# EAGLE schematic untitled (EAGLE 8.7.0)
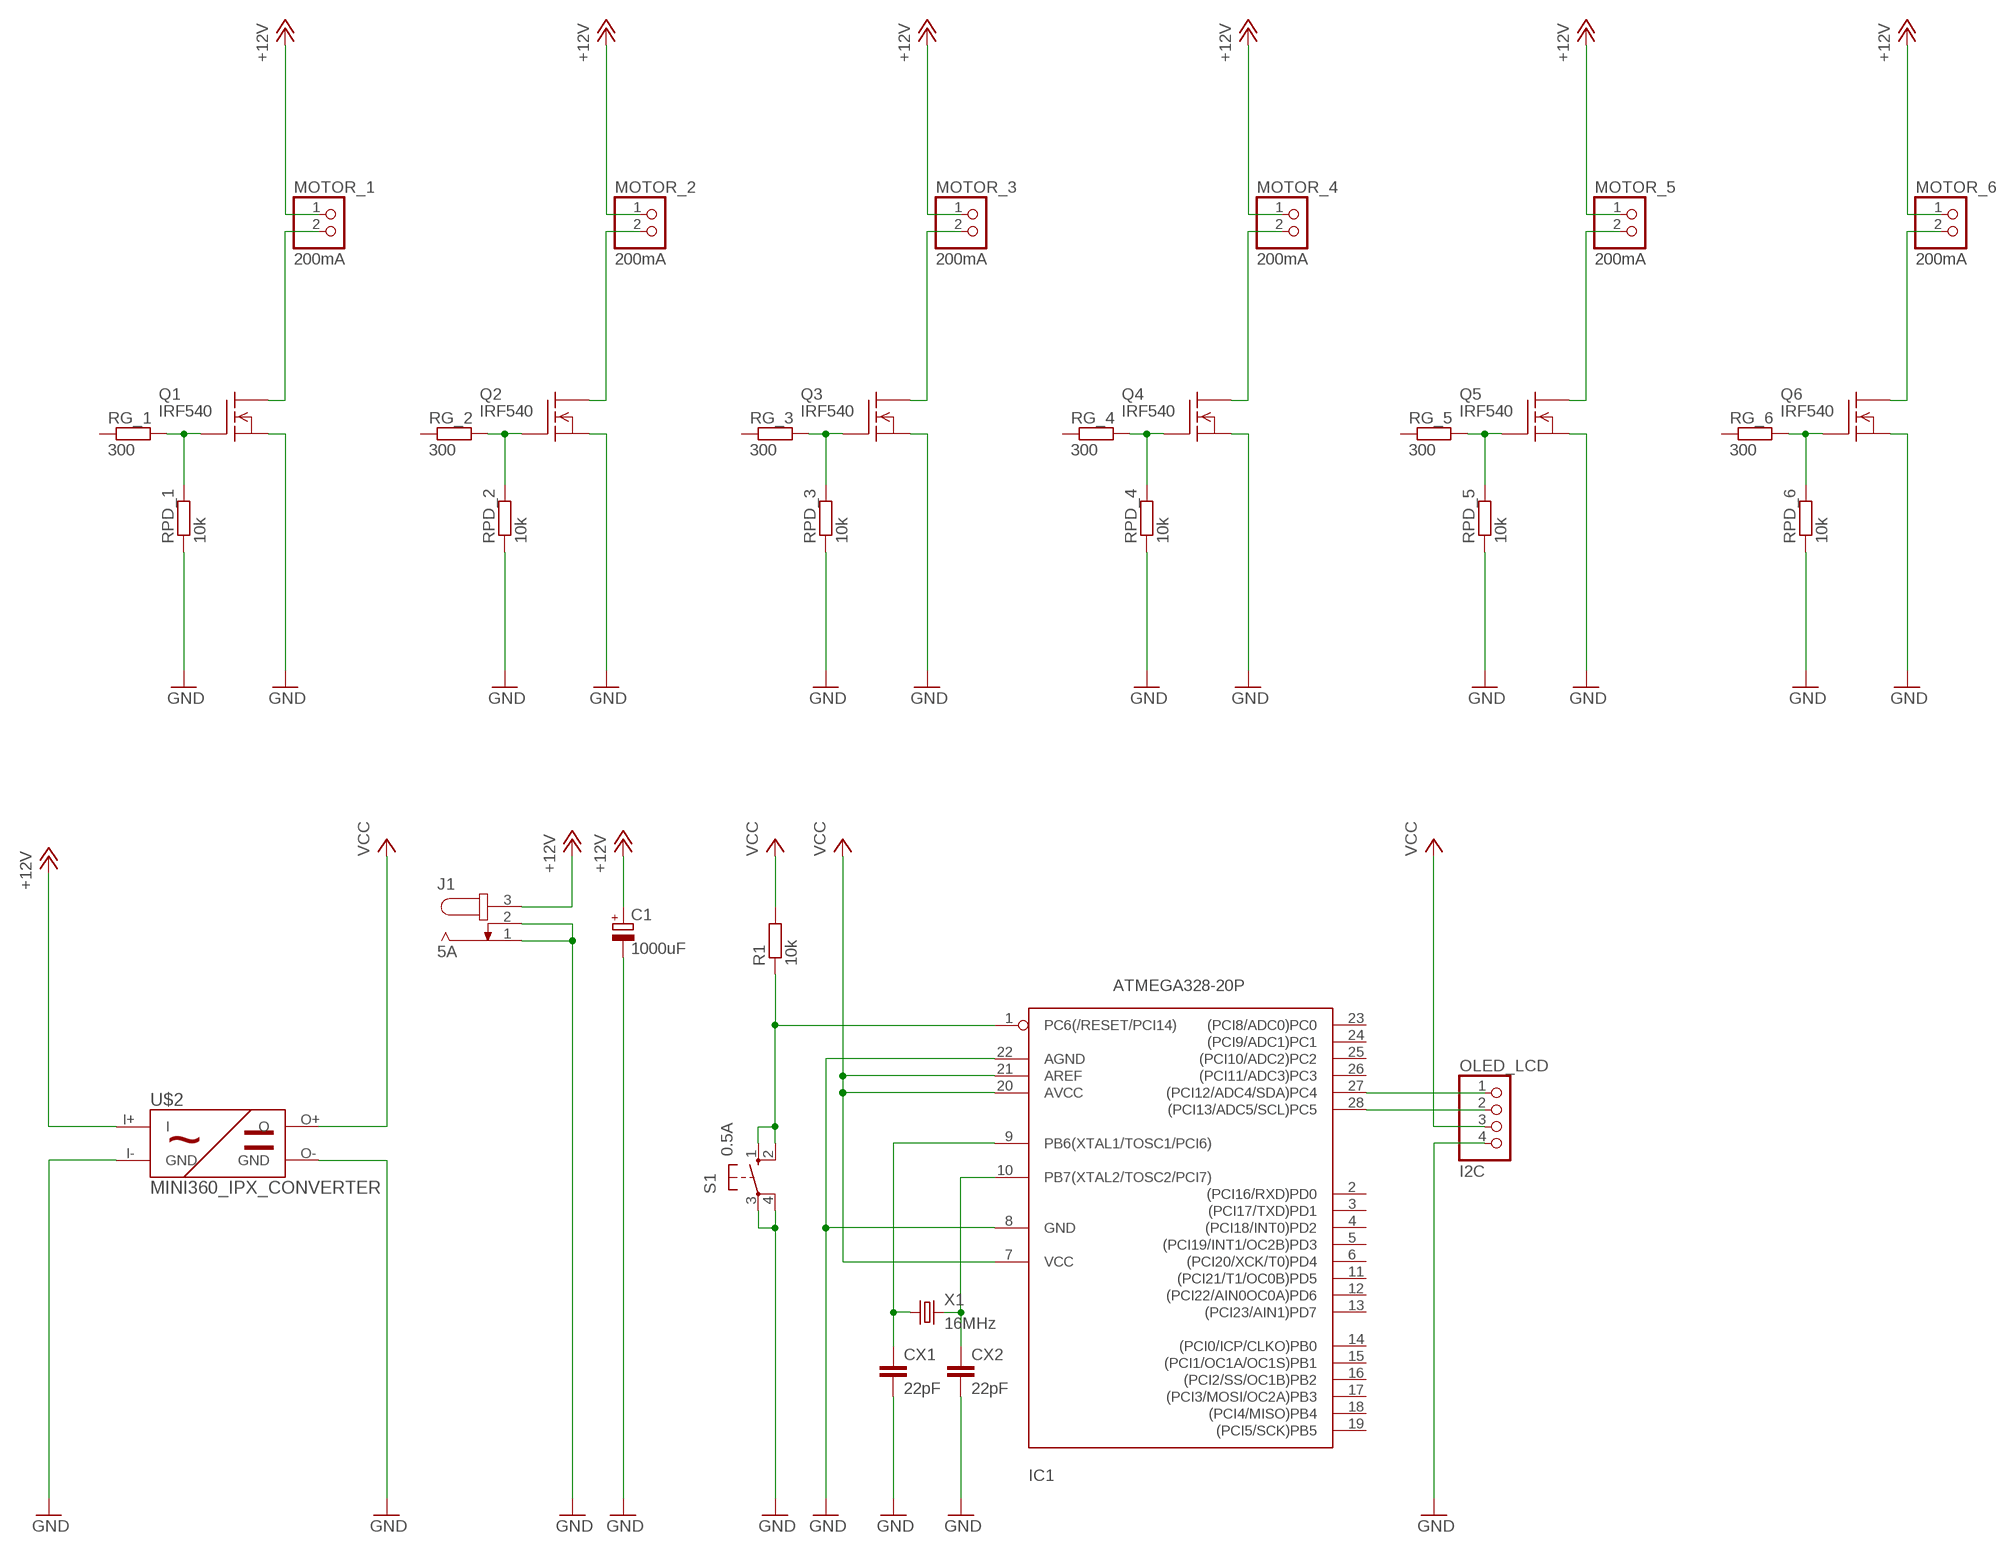
[diagram p0: schematic, sheet 1]

## Parts
C1  1000uF  CPOL-EUE5-8.5  [E5-8,5]
CX1  22pF  C-EU050-025X075  [C050-025X075]
CX2  22pF  C-EU050-025X075  [C050-025X075]
IC1  ATMEGA328-20P  [DIL28-3]
J1  5A  JACK-PLUG1  [SPC4078]
MOTOR_1  200mA  PINHD-1X2  [1X02]
MOTOR_2  200mA  PINHD-1X2  [1X02]
MOTOR_3  200mA  PINHD-1X2  [1X02]
MOTOR_4  200mA  PINHD-1X2  [1X02]
MOTOR_5  200mA  PINHD-1X2  [1X02]
MOTOR_6  200mA  PINHD-1X2  [1X02]
OLED_LCD  I2C  PINHD-1X4  [1X04]
Q1  IRF540  [TO220]
Q2  IRF540  [TO220]
Q3  IRF540  [TO220]
Q4  IRF540  [TO220]
Q5  IRF540  [TO220]
Q6  IRF540  [TO220]
R1  10k  R-EU_0207/10  [0207/10]
RG_1  300  R-EU_0207/10  [0207/10]
RG_2  300  R-EU_0207/10  [0207/10]
RG_3  300  R-EU_0207/10  [0207/10]
RG_4  300  R-EU_0207/10  [0207/10]
RG_5  300  R-EU_0207/10  [0207/10]
RG_6  300  R-EU_0207/10  [0207/10]
RPD_1  10k  R-EU_0207/10  [0207/10]
RPD_2  10k  R-EU_0207/10  [0207/10]
RPD_3  10k  R-EU_0207/10  [0207/10]
RPD_4  10k  R-EU_0207/10  [0207/10]
RPD_5  10k  R-EU_0207/10  [0207/10]
RPD_6  10k  R-EU_0207/10  [0207/10]
S1  0.5A  10-XX  [B3F-10XX]
U$2  MINI360_IPX_CONVERTER  [MINI360_IPX_CONVERTER]
X1  16MHz  CRYSTALHC49S  [HC49/S]

## Nets
+12V: C1.+ J1.3 MOTOR_1.1 MOTOR_2.1 MOTOR_3.1 MOTOR_4.1 MOTOR_5.1 MOTOR_6.1 U$2.I+(I)
GND: C1.- CX1.2 CX2.2 IC1.8(GND) IC1.22(AGND) J1.1 J1.2 OLED_LCD.4 Q1.3(S) Q2.3(S) Q3.3(S) Q4.3(S) Q5.3(S) Q6.3(S) RPD_1.1 RPD_2.1 RPD_3.1 RPD_4.1 RPD_5.1 RPD_6.1 S1.3(P) S1.4(P1) U$2.I-(GND) U$2.O-(GND)
N$1: IC1.1(PC6(/RESET/PCI14)) R1.1 S1.1(S) S1.2(S1)
N$2: CX1.1 IC1.9(PB6(XTAL1/TOSC1/PCI6)) X1.1
N$3: CX2.1 IC1.10(PB7(XTAL2/TOSC2/PCI7)) X1.2
N$4: Q1.1(G) RG_1.2 RPD_1.2
N$5: Q2.1(G) RG_2.2 RPD_2.2
N$6: MOTOR_1.2 Q1.2(D)
N$7: MOTOR_2.2 Q2.2(D)
N$8: Q3.1(G) RG_3.2 RPD_3.2
N$9: MOTOR_3.2 Q3.2(D)
N$10: Q4.1(G) RG_4.2 RPD_4.2
N$11: MOTOR_4.2 Q4.2(D)
N$12: Q5.1(G) RG_5.2 RPD_5.2
N$13: MOTOR_5.2 Q5.2(D)
N$14: Q6.1(G) RG_6.2 RPD_6.2
N$15: MOTOR_6.2 Q6.2(D)
N$16: IC1.27((PCI12/ADC4/SDA)PC4) OLED_LCD.1
N$17: IC1.28((PCI13/ADC5/SCL)PC5) OLED_LCD.2
VCC: IC1.7(VCC) IC1.20(AVCC) IC1.21(AREF) OLED_LCD.3 R1.2 U$2.O+(O)
Unconnected: IC1.2((PCI16/RXD)PD0) IC1.3((PCI17/TXD)PD1) IC1.4((PCI18/INT0)PD2) IC1.5((PCI19/INT1/OC2B)PD3) IC1.6((PCI20/XCK/T0)PD4) IC1.11((PCI21/T1/OC0B)PD5) IC1.12((PCI22/AIN0OC0A)PD6) IC1.13((PCI23/AIN1)PD7) IC1.14((PCI0/ICP/CLKO)PB0) IC1.15((PCI1/OC1A/OC1S)PB1) IC1.16((PCI2/SS/OC1B)PB2) IC1.17((PCI3/MOSI/OC2A)PB3) IC1.18((PCI4/MISO)PB4) IC1.19((PCI5/SCK)PB5) IC1.23((PCI8/ADC0)PC0) IC1.24((PCI9/ADC1)PC1) IC1.25((PCI10/ADC2)PC2) IC1.26((PCI11/ADC3)PC3) RG_1.1 RG_2.1 RG_3.1 RG_4.1 RG_5.1 RG_6.1

## Library data of the parts
C1 = rcl:CPOL-EU: POLARIZED CAPACITOR, European symbol; SPICEPREFIX: C
CX1 CX2 = rcl:C-EU: CAPACITOR, European symbol; SPICEPREFIX: C
IC1 = atmega328:ATMEGA328*P: MICROCONTROLLER 32 kBytes FLASH 2 kBytes SRAM 1 kBytes EEPROM USART 8-channel 10 bit ADC
J1 = con-jack:JACK-PLUG: DC POWER JACK Power Jack, DC, Right Angle, Through Hole, Rated 5A at 16VDC, PC Terminals Distributor: Farnell (www.Farnell.de) Drawing: 84N1161.pdf / 84N1162.pdf Manufacturer: SPC Technology (www.spctechnology.com) Type: SPC4077 / SPC 4078; OC_FARNELL: unknown; OC_NEWARK: unknown
MOTOR_1-MOTOR_6 = pinhead:PINHD-1X2: PIN HEADER
OLED_LCD = pinhead:PINHD-1X4: PIN HEADER
Q1-Q6 = transistor-fet:IRF540: N-Channel Enhancement MOSFET (HEXFET); 100V; 28A; 0,077Ohm
R1 RG_1-RG_6 RPD_1-RPD_6 = rcl:R-EU_: RESISTOR, European symbol; SPICEPREFIX: R
S1 = switch-omron:10-XX: OMRON SWITCH; MPN: B3F-1000; OC_FARNELL: 176432; OC_NEWARK: 36M3542
U$2 = ipx_lib:MINI360_IPX_CONVERTER: MINI360 Buck converter
X1 = crystal:CRYSTAL: CRYSTAL; OC_FARNELL: 1667008; OC_NEWARK: unknown